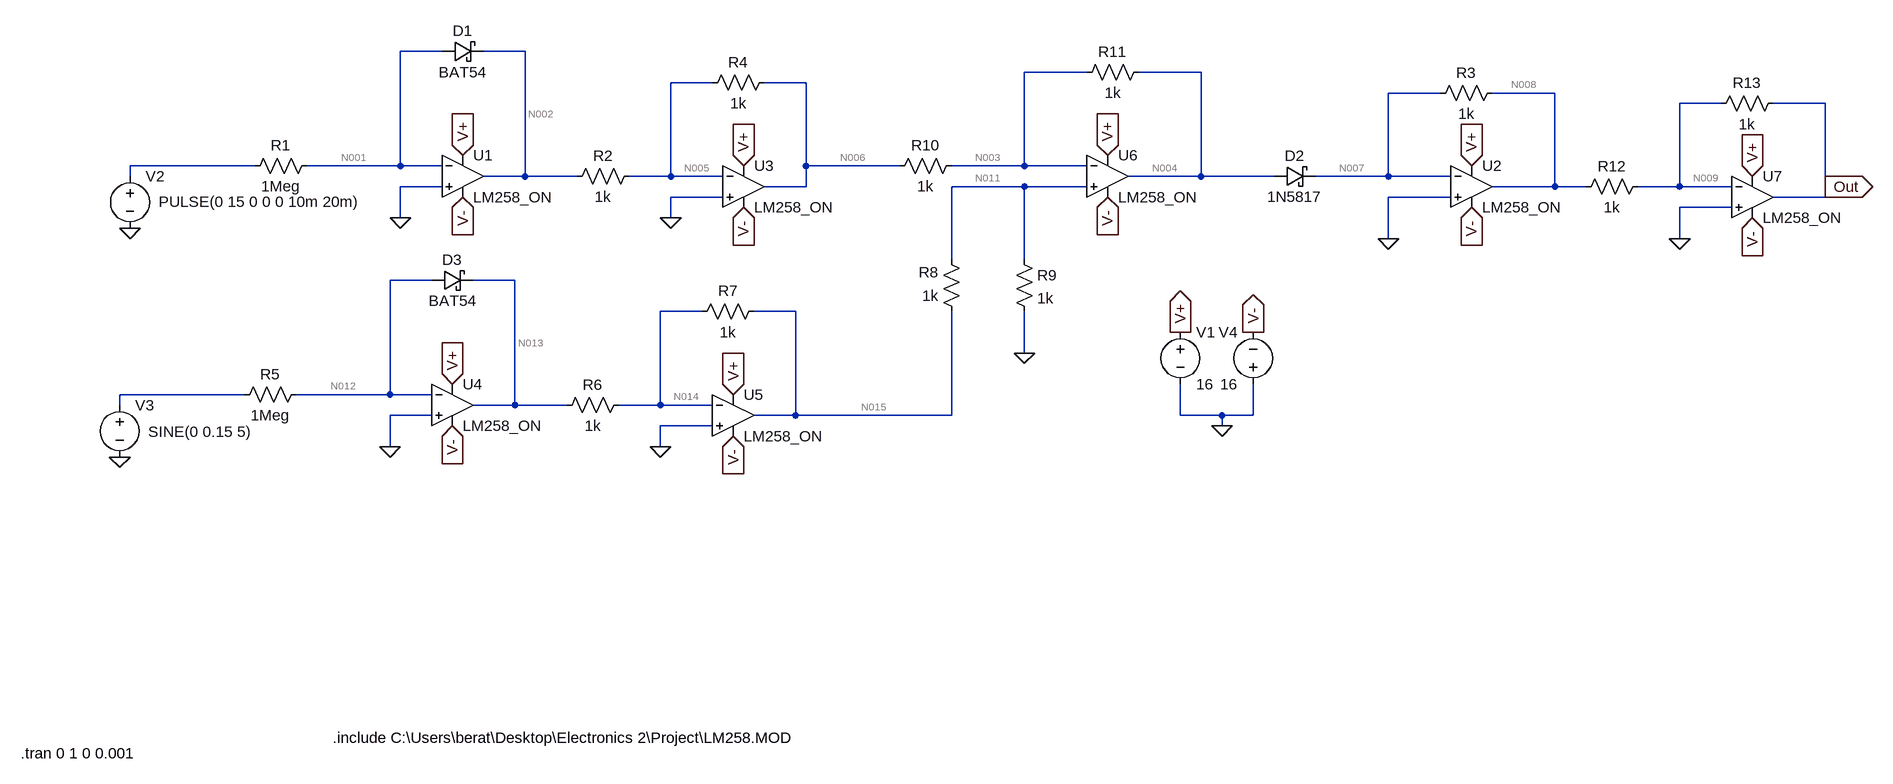
[diagram p0: schematic Draft1.asc]
Draft1.asc, the LTspice schematic file:
Version 4
SHEET 1 2044 680
WIRE -144 -448 -208 -448
WIRE -16 -448 -80 -448
WIRE 848 -416 752 -416
WIRE 1024 -416 928 -416
WIRE 272 -400 208 -400
WIRE 416 -400 352 -400
WIRE 1392 -384 1312 -384
WIRE 1568 -384 1472 -384
WIRE 1824 -368 1760 -368
WIRE 1984 -368 1904 -368
WIRE -432 -272 -624 -272
WIRE -208 -272 -208 -448
WIRE -208 -272 -352 -272
WIRE -144 -272 -208 -272
WIRE 416 -272 416 -400
WIRE 560 -272 416 -272
WIRE 752 -272 752 -416
WIRE 752 -272 640 -272
WIRE 848 -272 752 -272
WIRE -624 -256 -624 -272
WIRE -16 -256 -16 -448
WIRE -16 -256 -80 -256
WIRE 64 -256 -16 -256
WIRE 208 -256 208 -400
WIRE 208 -256 144 -256
WIRE 288 -256 208 -256
WIRE 1024 -256 1024 -416
WIRE 1024 -256 912 -256
WIRE 1136 -256 1024 -256
WIRE 1312 -256 1312 -384
WIRE 1312 -256 1200 -256
WIRE 1408 -256 1312 -256
WIRE -144 -240 -208 -240
WIRE 416 -240 416 -272
WIRE 416 -240 352 -240
WIRE 752 -240 640 -240
WIRE 848 -240 752 -240
WIRE 1568 -240 1568 -384
WIRE 1568 -240 1472 -240
WIRE 1616 -240 1568 -240
WIRE 1760 -240 1760 -368
WIRE 1760 -240 1696 -240
WIRE 1840 -240 1760 -240
WIRE 1984 -240 1984 -368
WIRE 288 -224 208 -224
WIRE 1408 -224 1312 -224
WIRE 1984 -224 1984 -240
WIRE 1984 -224 1904 -224
WIRE 1840 -208 1760 -208
WIRE -208 -192 -208 -240
WIRE 208 -192 208 -224
WIRE 1312 -160 1312 -224
WIRE 1760 -160 1760 -208
WIRE 640 -128 640 -240
WIRE 752 -128 752 -240
WIRE -160 -96 -224 -96
WIRE -32 -96 -96 -96
WIRE 256 -48 192 -48
WIRE 400 -48 336 -48
WIRE 752 16 752 -48
WIRE -448 80 -640 80
WIRE -224 80 -224 -96
WIRE -224 80 -368 80
WIRE -160 80 -224 80
WIRE -640 96 -640 80
WIRE -32 96 -32 -96
WIRE -32 96 -96 96
WIRE 48 96 -32 96
WIRE 192 96 192 -48
WIRE 192 96 128 96
WIRE 272 96 192 96
WIRE -160 112 -224 112
WIRE 400 112 400 -48
WIRE 400 112 336 112
WIRE 640 112 640 -48
WIRE 640 112 400 112
WIRE 992 112 992 64
WIRE 1056 112 992 112
WIRE 1104 112 1104 64
WIRE 1104 112 1056 112
WIRE 272 128 192 128
WIRE 1056 128 1056 112
WIRE -224 160 -224 112
WIRE 192 160 192 128
FLAG 1056 128 0
FLAG 992 -16 V+
IOPIN 992 -16 Out
FLAG 1104 -16 V-
IOPIN 1104 -16 Out
FLAG -112 -288 V+
IOPIN -112 -288 In
FLAG -112 -224 V-
IOPIN -112 -224 In
FLAG -624 -176 0
FLAG 1440 -272 V+
IOPIN 1440 -272 In
FLAG 1440 -208 V-
IOPIN 1440 -208 In
FLAG -208 -192 0
FLAG 1312 -160 0
FLAG 320 -272 V+
IOPIN 320 -272 In
FLAG 320 -208 V-
IOPIN 320 -208 In
FLAG -128 64 V+
IOPIN -128 64 In
FLAG -128 128 V-
IOPIN -128 128 In
FLAG -640 176 0
FLAG -224 160 0
FLAG 304 80 V+
IOPIN 304 80 In
FLAG 304 144 V-
IOPIN 304 144 In
FLAG 208 -192 0
FLAG 192 160 0
FLAG 880 -288 V+
IOPIN 880 -288 In
FLAG 880 -224 V-
IOPIN 880 -224 In
FLAG 1872 -256 V+
IOPIN 1872 -256 In
FLAG 1872 -192 V-
IOPIN 1872 -192 In
FLAG 1760 -160 0
FLAG 1984 -240 Out
IOPIN 1984 -240 Out
FLAG 752 16 0
SYMBOL OpAmps\\opamp2 -112 -320 R0
SYMATTR InstName U1
SYMATTR Value LM258_ON
SYMBOL voltage 992 -32 R0
WINDOW 123 0 0 Left 0
WINDOW 39 0 0 Left 0
SYMATTR InstName V1
SYMATTR Value 16
SYMBOL res -336 -288 R90
WINDOW 0 0 56 VBottom 2
WINDOW 3 32 56 VTop 2
SYMATTR InstName R1
SYMATTR Value 1Meg
SYMBOL schottky -144 -432 R270
WINDOW 0 32 32 VTop 2
WINDOW 3 0 32 VBottom 2
SYMATTR InstName D1
SYMATTR Value BAT54
SYMATTR Description Diode
SYMATTR Type diode
SYMBOL voltage -624 -272 R0
WINDOW 123 0 0 Left 0
WINDOW 39 0 0 Left 0
WINDOW 3 44 55 Left 2
SYMATTR Value PULSE(0 15 0 0 0 10m 20m)
SYMATTR InstName V2
SYMBOL res 160 -272 R90
WINDOW 0 0 56 VBottom 2
WINDOW 3 32 56 VTop 2
SYMATTR InstName R2
SYMATTR Value 1k
SYMBOL schottky 1136 -240 R270
WINDOW 0 32 32 VTop 2
WINDOW 3 0 32 VBottom 2
SYMATTR InstName D2
SYMATTR Value 1N5817
SYMATTR Description Diode
SYMATTR Type diode
SYMBOL OpAmps\\opamp2 1440 -304 R0
SYMATTR InstName U2
SYMATTR Value LM258_ON
SYMBOL res 1488 -400 R90
WINDOW 0 0 56 VBottom 2
WINDOW 3 32 56 VTop 2
SYMATTR InstName R3
SYMATTR Value 1k
SYMBOL OpAmps\\opamp2 320 -304 R0
SYMATTR InstName U3
SYMATTR Value LM258_ON
SYMBOL res 368 -416 R90
WINDOW 0 0 56 VBottom 2
WINDOW 3 32 56 VTop 2
SYMATTR InstName R4
SYMATTR Value 1k
SYMBOL OpAmps\\opamp2 -128 32 R0
SYMATTR InstName U4
SYMATTR Value LM258_ON
SYMBOL res -352 64 R90
WINDOW 0 0 56 VBottom 2
WINDOW 3 32 56 VTop 2
SYMATTR InstName R5
SYMATTR Value 1Meg
SYMBOL schottky -160 -80 R270
WINDOW 0 32 32 VTop 2
WINDOW 3 0 32 VBottom 2
SYMATTR InstName D3
SYMATTR Value BAT54
SYMATTR Description Diode
SYMATTR Type diode
SYMBOL voltage -640 80 R0
WINDOW 123 0 0 Left 0
WINDOW 39 0 0 Left 0
WINDOW 3 44 57 Left 2
SYMATTR Value SINE(0 0.15 5)
SYMATTR InstName V3
SYMBOL res 144 80 R90
WINDOW 0 0 56 VBottom 2
WINDOW 3 32 56 VTop 2
SYMATTR InstName R6
SYMATTR Value 1k
SYMBOL OpAmps\\opamp2 304 48 R0
SYMATTR InstName U5
SYMATTR Value LM258_ON
SYMBOL res 352 -64 R90
WINDOW 0 0 56 VBottom 2
WINDOW 3 32 56 VTop 2
SYMATTR InstName R7
SYMATTR Value 1k
SYMBOL voltage 1104 80 R180
WINDOW 0 24 96 Left 2
WINDOW 3 24 16 Left 2
WINDOW 123 0 0 Left 0
WINDOW 39 0 0 Left 0
SYMATTR InstName V4
SYMATTR Value 16
SYMBOL OpAmps\\opamp2 880 -320 R0
SYMATTR InstName U6
SYMATTR Value LM258_ON
SYMBOL OpAmps\\opamp2 1872 -288 R0
SYMATTR InstName U7
SYMATTR Value LM258_ON
SYMBOL res 1712 -256 R90
WINDOW 0 0 56 VBottom 2
WINDOW 3 32 56 VTop 2
SYMATTR InstName R12
SYMATTR Value 1k
SYMBOL res 1920 -384 R90
WINDOW 0 0 56 VBottom 2
WINDOW 3 32 56 VTop 2
SYMATTR InstName R13
SYMATTR Value 1k
SYMBOL res 656 -32 R180
WINDOW 0 36 76 Left 2
WINDOW 3 36 40 Left 2
SYMATTR InstName R8
SYMATTR Value 1k
SYMBOL res 736 -144 R0
SYMATTR InstName R9
SYMATTR Value 1k
SYMBOL res 656 -288 R90
WINDOW 0 0 56 VBottom 2
WINDOW 3 32 56 VTop 2
SYMATTR InstName R10
SYMATTR Value 1k
SYMBOL res 944 -432 R90
WINDOW 0 0 56 VBottom 2
WINDOW 3 32 56 VTop 2
SYMATTR InstName R11
SYMATTR Value 1k
TEXT -312 608 Left 2 !.include C:\\Users\\berat\\Desktop\\Electronics 2\\Project\\LM258.MOD
TEXT -792 632 Left 2 !.tran 0 1 0 0.001

The netlist it stands for:
* Draft1.asc
XU1 0 N001 V+ V- N002 LM258_ON  ; pins In+ In- V+ V- OUT
V1 V+ 0 16
R1 N001 N010 1Meg
D1 N001 N002 BAT54
V2 N010 0 PULSE(0 15 0 0 0 10m 20m)
R2 N005 N002 1k
D2 N004 N007 1N5817
XU2 0 N007 V+ V- N008 LM258_ON  ; pins In+ In- V+ V- OUT
R3 N008 N007 1k
XU3 0 N005 V+ V- N006 LM258_ON  ; pins In+ In- V+ V- OUT
R4 N006 N005 1k
XU4 0 N012 V+ V- N013 LM258_ON  ; pins In+ In- V+ V- OUT
R5 N012 N016 1Meg
D3 N012 N013 BAT54
V3 N016 0 SINE(0 0.15 5)
R6 N014 N013 1k
XU5 0 N014 V+ V- N015 LM258_ON  ; pins In+ In- V+ V- OUT
R7 N015 N014 1k
V4 0 V- 16
XU6 N011 N003 V+ V- N004 LM258_ON  ; pins In+ In- V+ V- OUT
XU7 0 N009 V+ V- Out LM258_ON  ; pins In+ In- V+ V- OUT
R12 N009 N008 1k
R13 Out N009 1k
R8 N015 N011 1k
R9 N011 0 1k
R10 N003 N006 1k
R11 N004 N003 1k
.model D D
.lib standard.dio
.include C:\Users\berat\Desktop\Electronics 2\Project\LM258.MOD
.tran 0 1 0 0.001
.backanno
.end

* Results of the author's LTspice run, read from the files saved beside the schematic
* Operating Point, zero values left out:
*   V(v-) = -16 V
*   V(n001) = -1.035 mV
*   V(v+) = 16 V
*   V(n002) = -10.5 mV
*   V(n005) = -1.035 mV
*   V(n004) = -2.067 mV
*   V(n007) = -1.035 mV
*   V(n008) = -169.3 µV
*   V(n006) = 8.386 mV
*   V(n012) = -1.035 mV
*   V(n013) = -10.5 mV
*   V(n014) = -1.035 mV
*   V(n015) = 8.386 mV
*   V(n003) = 3.181 mV
*   V(n011) = 4.216 mV
*   V(n009) = -1.035 mV
*   V(out) = -1.943 mV
*   I(D2) = -908.5 nA
*   I(D3) = 44.18 nA
*   I(D1) = 44.18 nA
*   I(R11) = -5.249 µA
*   I(R10) = -5.205 µA
*   I(R9) = 4.216 µA
*   I(R8) = 4.17 µA
*   I(R13) = -908.5 nA
*   I(R12) = -865.4 nA
*   I(R7) = 9.421 µA
*   I(R6) = 9.464 µA
*   I(R5) = -1.035 nA
*   I(R4) = 9.421 µA
*   I(R3) = 865.4 nA
*   I(R2) = 9.464 µA
*   I(R1) = -1.035 nA
*   I(V4) = -9.217 mA
*   I(V3) = -1.035 nA
*   I(V2) = -1.035 nA
*   I(V1) = 4.426 mA
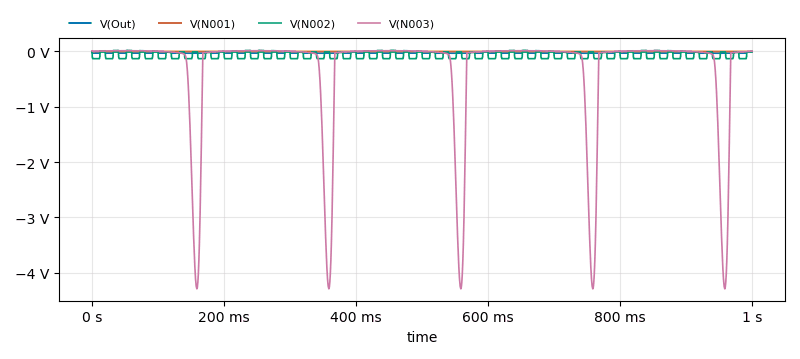
[diagram p1: Transient Analysis of Draft1.asc, plotted from the saved traces]
* Transient Analysis, 1 run:
*   V(Out): min -32.92 mV, max 18.98 mV, average -20.63 mV, rms 27.11 mV, last -1.946 mV
*   V(N001): min -1.36 mV, max -680.1 µV, average -1.033 mV, rms 1.034 mV, last -1.035 mV
*   V(N002): min -131 mV, max -10.49 mV, average -80.25 mV, rms 98.94 mV, last -10.5 mV
*   V(N003): min -4.292 V, max 12.43 mV, average -305.2 mV, rms 996.8 mV, last 3.18 mV